# EAGLE design APP_UD_Sigle_new (EAGLE 6.6.0)
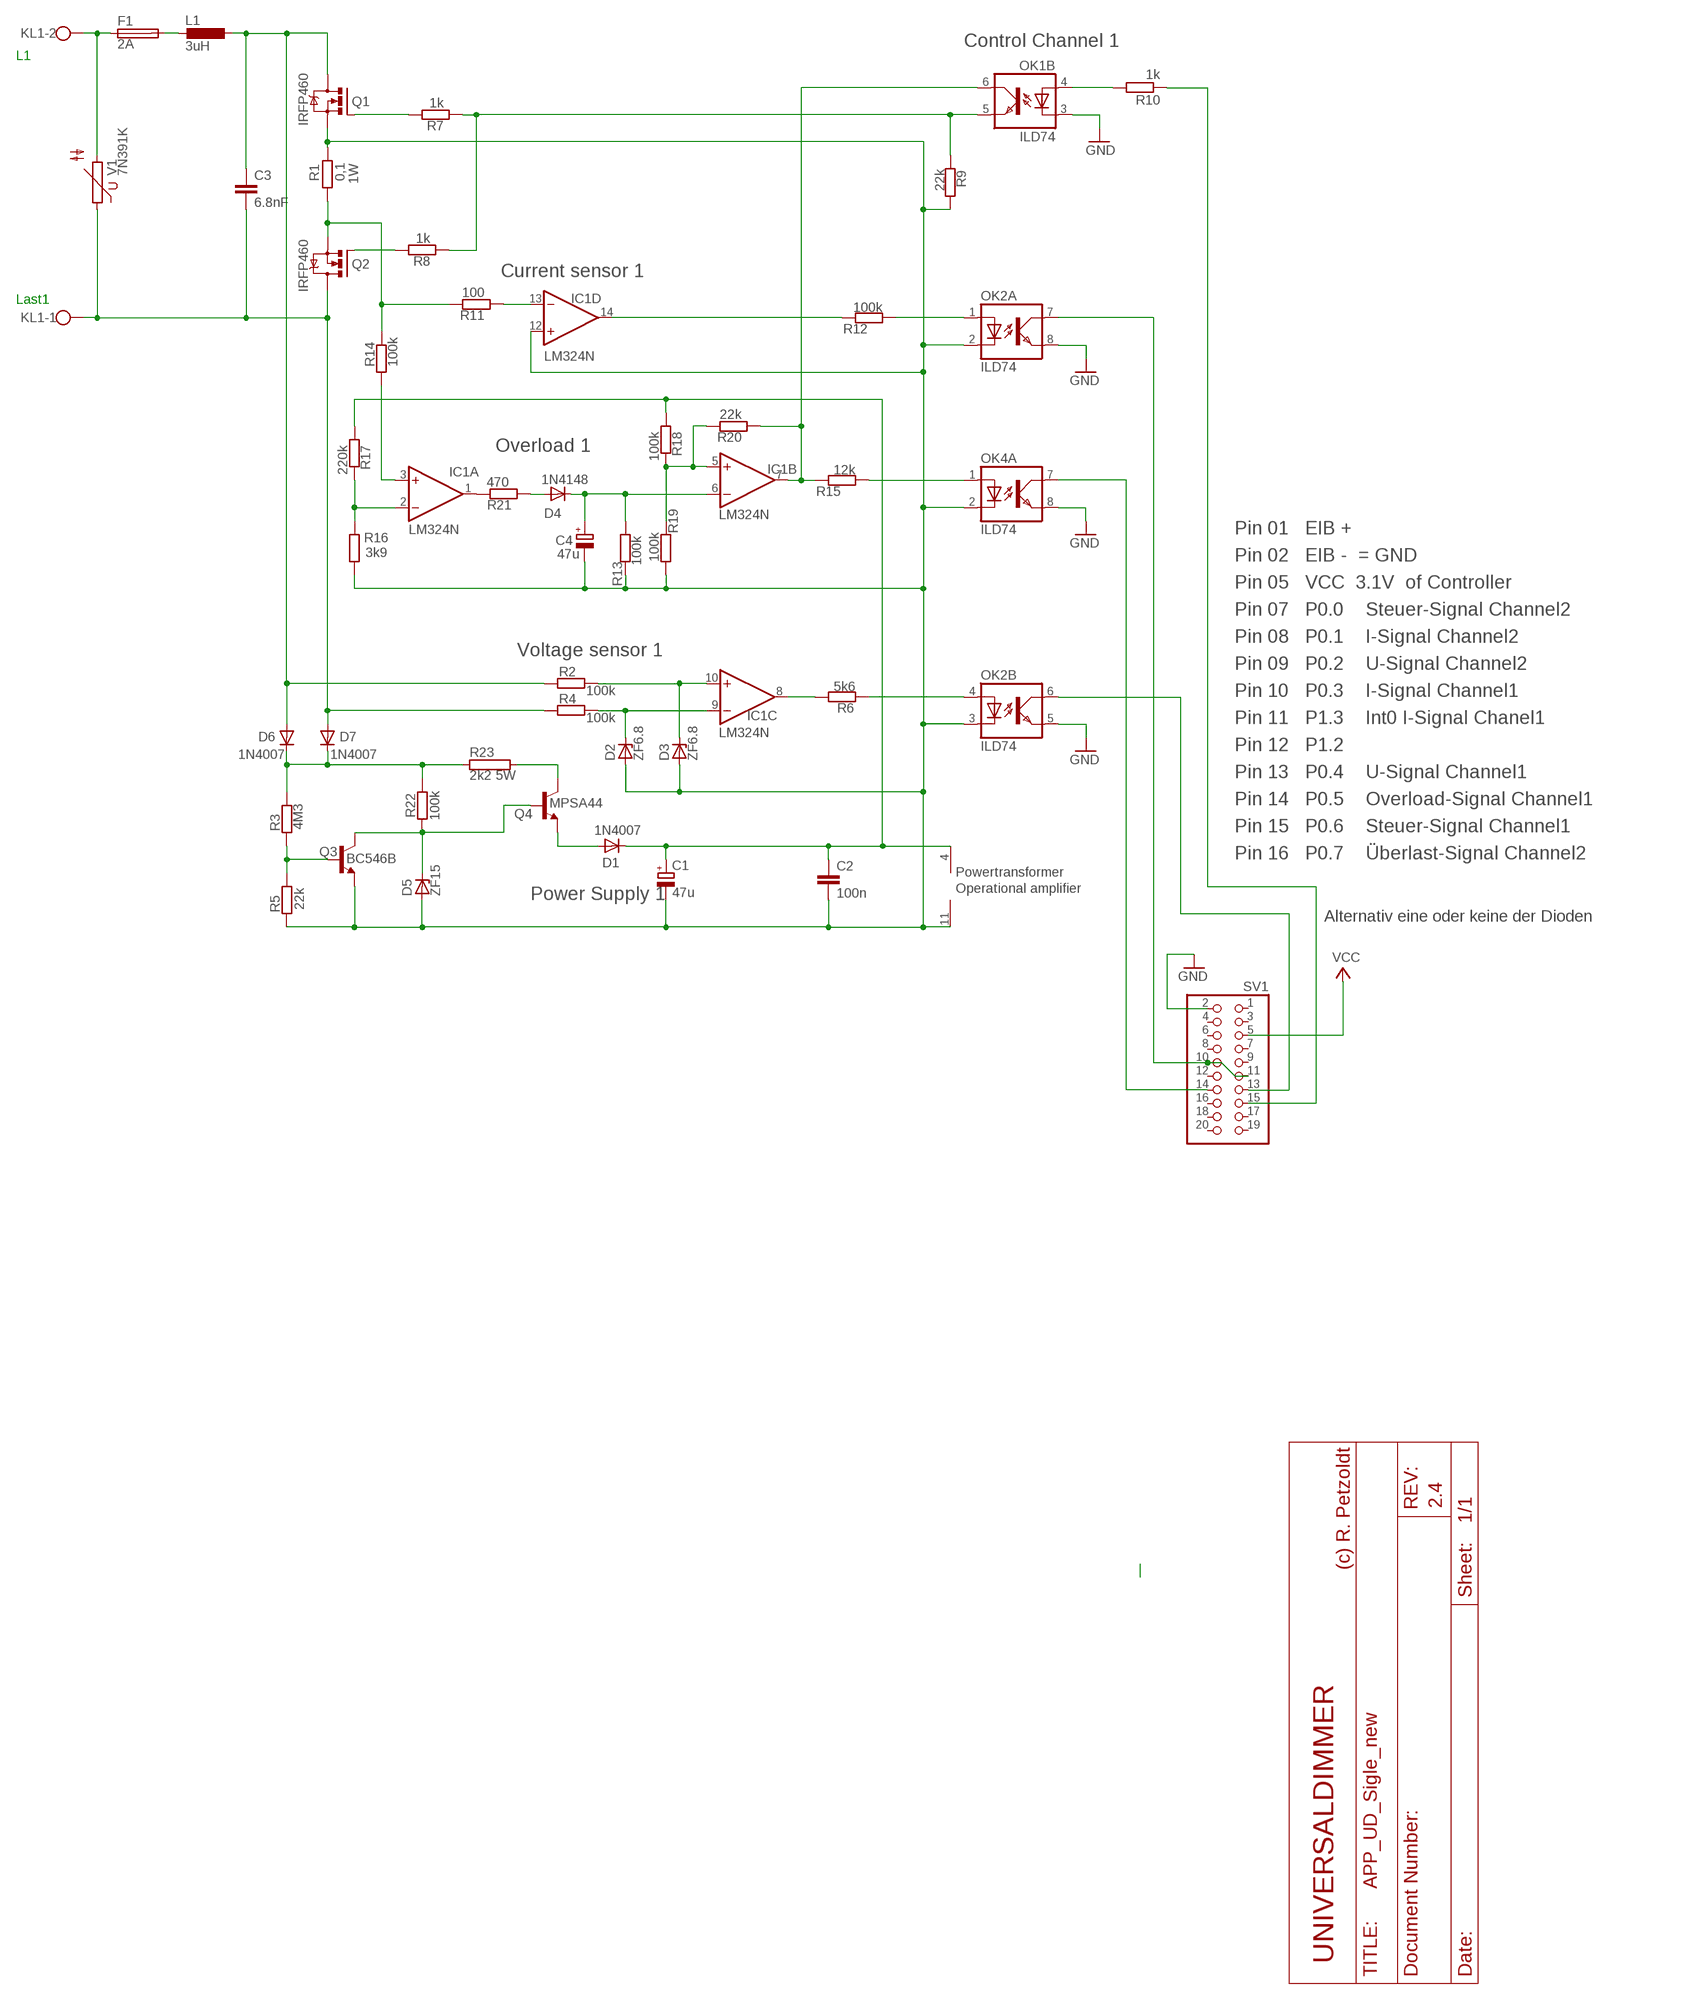
[diagram p0: schematic, sheet 1]
UNIVERSALDIMMER (DOCFIELD): COPYRIGHT: (c) R. Petzoldt; REV: 2.4

## Parts
C1  47u  CPOL-EUE2-5  [E2-5]
C2  100n  C-EU025-030X050  [C025-030X050]
C3  6.8nF  C-EU050-075X075  [C050-075X075]
C4  47u  CPOL-EUE2-5  [E2-5]
D1  1N4007  1N4148DO35-7S  [D-7]
D2  ZF6.8  ZENER-DIODEZD-5  [ZDIO-5]
D3  ZF6.8  ZENER-DIODEZD-7.5  [ZDIO-7.5]
D4  1N4148  1N4148DO35-7S  [D-7]
D5  ZF15  ZENER-DIODEZD-7.5  [ZDIO-7.5]
D6  1N4007  DIODE-D-7.5  [D-7.5]
D7  1N4007  DIODE-D-7.5  [D-7.5]
F1  2A  TR5  [TR5]
IC1  LM324N  [DIL14]
KL1  W237-102  [W237-102]
L1  3uH  L-EU414V  [0414V]
OK1  ILD74  ILD2  [DIL08]
OK2  ILD74  ILD2  [DIL08]
OK4  ILD74  ILD2  [DIL08]
Q1  IRFP460  IRFPC40  [TO247BV]
Q2  IRFP460  IRFPC40  [TO247BV]
Q3  BC546B  [TO92-EBC]
Q4  MPSA44  MPSA44-NPN-TO92-EBC  [TO92-EBC]
R1  0,1  R-EU_0414/5V  [0414V]
R2  100k  R-EU_0204/7  [0204/7]
R3  4M3  R-EU_0204/7  [0204/7]
R4  100k  R-EU_0204/7  [0204/7]
R5  22k  R-EU_0204/7  [0204/7]
R6  5k6  R-EU_0204/7  [0204/7]
R7  1k  R-EU_0204/7  [0204/7]
R8  1k  R-EU_0204/7  [0204/7]
R9  22k  R-EU_0204/7  [0204/7]
R10  1k  R-EU_0204/7  [0204/7]
R11  100  R-EU_0204/7  [0204/7]
R12  100k  R-EU_0204/7  [0204/7]
R13  100k  R-EU_0204/7  [0204/7]
R14  100k  R-EU_0204/7  [0204/7]
R15  12k  R-EU_0204/7  [0204/7]
R16  3k9  R-EU_0204/7  [0204/7]
R17  220k  R-EU_0204/7  [0204/7]
R18  100k  R-EU_0204/7  [0204/7]
R19  100k  R-EU_0204/7  [0204/7]
R20  22k  R-EU_0204/7  [0204/7]
R21  470  R-EU_0204/7  [0204/7]
R22  100k  R-EU_0204/7  [0204/7]
R23  2k2 5W  R  [KH208-8_10B]
SV1  PINHD-2X10  [2X10]
V1  7N391K  S05K11  [S05K11]

## Nets
AGND1: C1.- C2.2 C4.- D2.A D3.A D5.A IC1.11(P:V-) IC1.12(D:+IN) OK2.2(A:C) OK2.3(B:C) OK4.2(A:C) Q1.S Q3.E R1.2 R5.1 R9.2 R13.2 R16.2 R19.1
GND: OK1.3(B:C) OK2.5(B:EMIT) OK2.8(A:EMIT) OK4.8(A:EMIT) SV1.2
N$1: R10.1 SV1.15
N$2: OK1.4(B:A) R10.2
N$3: C3.1 D6.A L1.1 Q1.D R2.1
N$4: Q2.S R1.1 R11.2 R14.2
N$5: OK2.6(B:COL) SV1.13
N$6: IC1.7(B:OUT) OK1.6(B:COL) R15.2 R20.1
N$7: OK2.7(A:COL) SV1.10 SV1.11
N$8: F1.1 KL1.2 V1.2
N$9: Q2.G R8.2
N$11: IC1.3(A:+IN) R14.1
N$12: D6.C D7.C R3.2 R22.2 R23.P$1
N$13: OK2.4(B:A) R6.1
N$15: IC1.8(C:OUT) R6.2
N$16: Q3.B R3.1 R5.2
N$17: Q1.G R7.2
N$18: C3.2 D7.A KL1.1 Q2.D R4.1 V1.1
N$21: IC1.2(A:-IN) R16.1 R17.2
N$22: F1.2 L1.2
N$23: D3.C IC1.10(C:+IN) R2.2
N$24: D2.C IC1.9(C:-IN) R4.2
N$25: IC1.1(A:OUT) R21.2
N$28: OK2.1(A:A) R12.1
N$30: C4.+ D4.C IC1.6(B:-IN) R13.1
N$31: D5.C Q3.C Q4.B R22.1
N$32: OK4.1(A:A) R15.1
N$33: OK4.7(A:COL) SV1.14
N$34: IC1.5(B:+IN) R18.2 R19.2 R20.2
N$35: Q4.C R23.P$2
N$47: D1.A Q4.E
N$48: IC1.14(D:OUT) R12.2
N$64: D4.A R21.1
N$69: OK1.5(B:EMIT) R7.1 R8.1 R9.1
N$74: IC1.13(D:-IN) R11.1
V12-C1: C1.+ C2.1 D1.C IC1.4(P:V+) R17.1 R18.1
VCC: SV1.5
Unconnected: OK1.1(A:A) OK1.2(A:C) OK1.7(A:COL) OK1.8(A:EMIT) OK4.3(B:C) OK4.4(B:A) OK4.5(B:EMIT) OK4.6(B:COL) SV1.1 SV1.3 SV1.4 SV1.6 SV1.7 SV1.8 SV1.9 SV1.12 SV1.16 SV1.17 SV1.18 SV1.19 SV1.20

## Notes on the sheet
- Control Channel 1
- L1
- 1W
- Current sensor 1
- Last1
- Overload 1
- Pin 01   EIB +
- Pin 02   EIB -  = GND
- Pin 05   VCC  3.1V  of Controller
- Pin 07   P0.0    Steuer-Signal Channel2
- Pin 08   P0.1    I-Signal Channel2
- Voltage sensor 1
- Pin 09   P0.2    U-Signal Channel2
- Pin 10   P0.3    I-Signal Channel1
- Pin 11   P1.3    Int0 I-Signal Chanel1
- Pin 12   P1.2
- Pin 13   P0.4    U-Signal Channel1
- Pin 14   P0.5    Overload-Signal Channel1
- Pin 15   P0.6    Steuer-Signal Channel1
- Pin 16   P0.7    Überlast-Signal Channel2
- Powertransformer
- Operational amplifier
- Power Supply 1
- Alternativ eine oder keine der Dioden

## Library data of the parts
C1 C4 = rcl:CPOL-EU: POLARIZED CAPACITOR, European symbol
C2 C3 = rcl:C-EU: CAPACITOR, European symbol
D1 D4 = diode:1N4148: DIODE high speed (Philips)
D2 D3 D5 = diode:ZENER-DIODE: Z-Diode
D6 D7 = diode:DIODE-: DIODE
F1 = fuse:TR5: FUSE Wickmann
IC1 = linear:LM324: OP AMP
KL1 = con-wago-500:W237-102: WAGO SCREW CLAMP
L1 = rcl:L-EU: INDUCTOR, European symbol
OK1 OK2 OK4 = optocoupler:ILD2: SIEMENS OPTO COUPLER
Q1 Q2 = transistor-power:IRFPC40: N-CHANNEL MOS FET
Q3 = transistor-npn:BC546*: NPN Transistor
Q4 = transistor:*-NPN-: NPN Transistror BF959 corrected 2008.03.06
R1-R22 = rcl:R-EU_: RESISTOR, European symbol
R23 = resistor-power:R: Power Resitor
SV1 = pinhead:PINHD-2X10: PIN HEADER
V1 = varistor:S05K11: VARISTOR

## Board
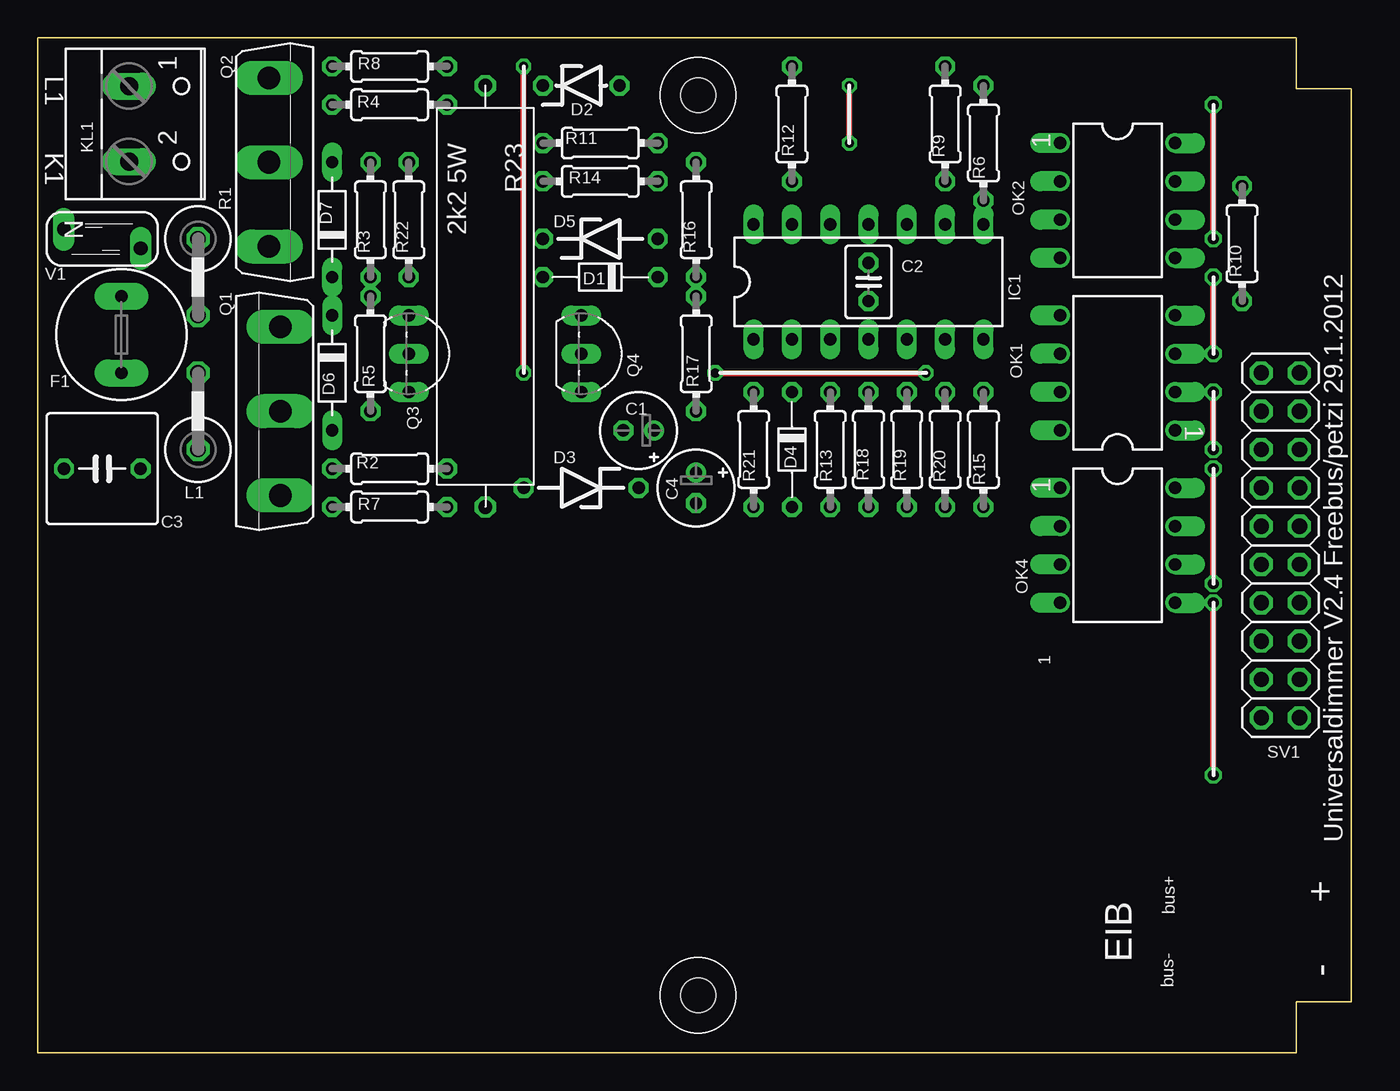
[diagram p1: board, top side]
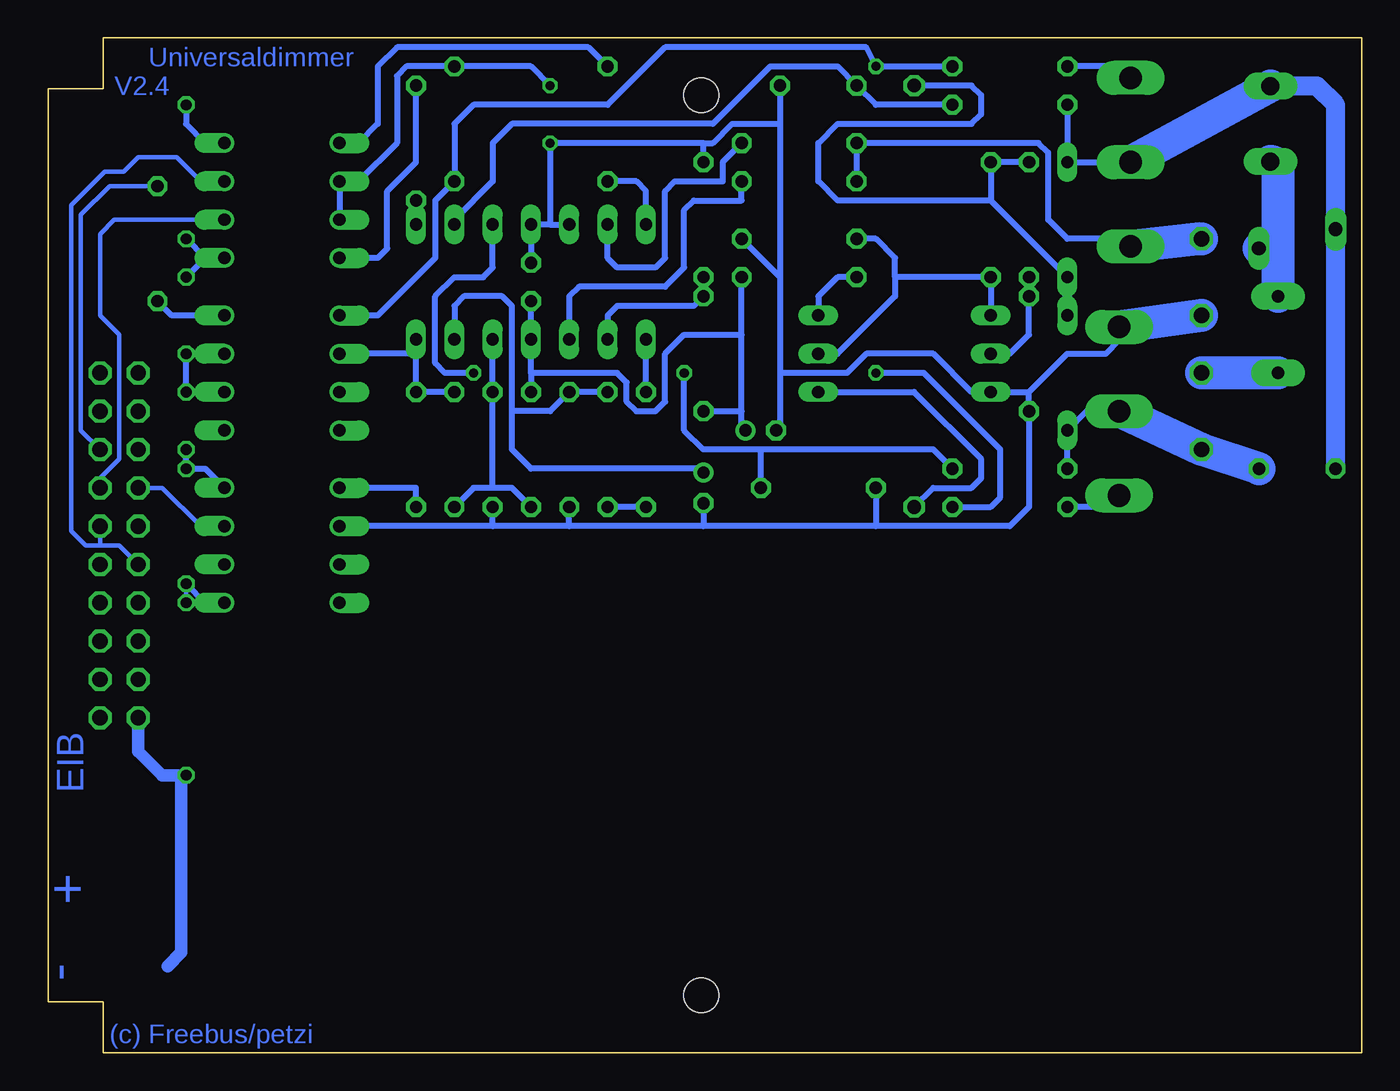
[diagram p2: board, bottom side, seen from below]

Size 87.1 x 67.31 mm. Coordinates in mm from the lower left corner, seen from the top.
Outline: 0,0.01 83.45,0 83.45,3.38 87.1,3.38 87.1,63.93 83.45,63.93 83.45,67.31 0,67.31 0,0.01
Copper layers (1*16): Top 0.035mm / dielectric 1.5mm / Bottom 0.035mm
Design rules "default": minimum track width 10mil, minimum drill 23mil, track to track 12mil, track to pad 12mil, pad to pad 16mil, via to via 16mil, smd to smd 8mil, copper to edge 10mil, drill to drill 10mil, minimum pad ring 10mil, minimum via ring 8mil, stop-mask expansion 4mil, vias tented up to drill 0mil, thermal gap 10mil
Holes 2.3 mm at 43.79,3.81 43.79,63.5

### Footprints (pad centres in the part's own frame; a part is rotated, then mirrored left to right if it is on the bottom)
E2-5 = drill 0.813 pad 1.27: + -1.016,0 | drill 0.813 pad 1.27 octagon: - 1.016,0
C025-030X050 = drill 0.813 octagon: 1 -1.27,0; 2 1.27,0
C050-075X075 = drill 0.813 octagon: 1 -2.54,0; 2 2.54,0
D-7 = drill 0.813 octagon: A 3.81,0; C -3.81,0
ZDIO-5 = drill 0.813 octagon: A 2.54,0; C -2.54,0
ZDIO-7.5 = drill 0.813 octagon: A 3.81,0; C -3.81,0
D-7.5 = drill 0.813 long: A 3.81,0; C -3.81,0
TR5 = drill 0.813 pad 1.778 long: 1 -2.54,0; 2 2.54,0
DIL14 = drill 0.813 long: 1 -7.62,-3.81; 2 -5.08,-3.81; 3 -2.54,-3.81; 4 0,-3.81; 5 2.54,-3.81; 6 5.08,-3.81; 7 7.62,-3.81; 8 7.62,3.81; 9 5.08,3.81; 10 2.54,3.81; 11 0,3.81; 12 -2.54,3.81; 13 -5.08,3.81; 14 -7.62,3.81
W237-102 = drill 1.194 long: 1 -2.5,-1.27; 2 2.5,-1.27
0414V = drill 1.016 octagon: 1 -2.54,0; 2 2.54,0
DIL08 = drill 0.813 offset: 1 -3.81,-3.81; 2 -1.27,-3.81; 3 1.27,-3.81; 4 3.81,-3.81; 5 3.81,3.81; 6 1.27,3.81; 7 -1.27,3.81; 8 -3.81,3.81
TO247BV = drill 1.499 long: D 0,-2.921; G -5.588,-2.921; S 5.588,-2.921
TO92-EBC = drill 0.813 long: B 0,-1.27; C -2.54,-1.27; E 2.54,-1.27
TO92-EBC' = drill 0.813 long: B 0,-1.27; C 2.54,-1.27; E -2.54,-1.27
0204/7 = drill 0.813 octagon: 1 -3.81,0; 2 3.81,0
KH208-8_10B = drill 0.9 octagon: P$1 -13.97,0; P$2 13.97,0
2X10 = drill 1.016 octagon: 1 -11.43,-1.27; 2 -11.43,1.27; 3 -8.89,-1.27; 4 -8.89,1.27; 5 -6.35,-1.27; 6 -6.35,1.27; 7 -3.81,-1.27; 8 -3.81,1.27; 9 -1.27,-1.27; 10 -1.27,1.27; 11 1.27,-1.27; 12 1.27,1.27; 13 3.81,-1.27; 14 3.81,1.27; 15 6.35,-1.27; 16 6.35,1.27; 17 8.89,-1.27; 18 8.89,1.27; 19 11.43,-1.27; 20 11.43,1.27
S05K11 = drill 0.914 long: 1 -0.635,-2.54; 2 0.635,2.54

### Placement (x,y rotation side)
C1  39.84,41.27 180 top
C2  55.08,51.12 90 top
C3  4.28,38.73 180 top
C4  43.65,37.46 270 top
D1  37.3,51.43 180 top
D2  36.03,64.14 0 top
D3  36.03,37.46 180 top
D4  50,40 270 top
D5  37.3,53.98 0 top
D6  19.52,45.09 270 top
D7  19.52,55.24 90 top
F1  5.55,47.62 270 top
IC1  55.08,51.12 0 top
KL1  7.32,61.59 270 top
L1  10.63,42.54 90 top
OK1  71.59,45.09 90 top
OK2  71.59,56.52 270 top
OK4  71.59,33.66 270 top
Q1  13.17,42.54 90 top
Q2  18.25,59.05 270 top
Q3  25.87,46.35 270 top
Q4  MPSA44  [TO92-EBC']  37.3,46.35 270 top
R1  10.63,51.43 270 top
R2  23.33,38.73 0 top
R3  22.06,55.24 90 top
R4  23.33,62.86 0 top
R5  22.06,46.35 90 top
R6  62.7,60.32 270 top
R7  23.33,36.2 180 top
R8  23.33,65.41 180 top
R9  60.16,61.59 90 top
R10  79.84,53.66 270 top
R11  37.3,60.32 180 top
R12  50,61.59 270 top
R13  52.54,40 270 top
R14  37.3,57.78 180 top
R15  62.7,40 90 top
R16  43.65,55.24 90 top
R17  43.65,46.35 90 top
R18  55.08,40 270 top
R19  57.62,40 90 top
R20  60.16,40 270 top
R21  47.46,40 90 top
R22  24.6,55.24 90 top
R23  29.68,50.16 270 top
SV1  82.38,33.66 90 top
V1  4.28,53.98 270 top

### Tracks (layer width: path | path; a pad name or v marks a point on that pad's centre or on a via)
AGND1  (via drill 0.6)
  Top 0.406: v53.81,60.32 v53.81,64.14
  Bottom 0.406: 52.54,34.92 57.62,34.92 | 57.62,34.92 OK4.2 | 52.54,34.92 R13.2 | 57.62,34.92 R19.1 | 32.22,34.92 23.33,34.92 22.06,36.2 R5.1 22.06,43.81 | 32.22,34.92 43.65,34.92 | 43.65,34.92 52.54,34.92 | OK2.3 OK2.2 66.51,57.78 63.97,60.32 63.97,64.77 63.34,65.41 R9.2 55.08,65.41 v53.81,64.14 | 53.81,54.93 IC1.12 | 53.81,54.93 IC1.11 C2.2 | 53.81,54.93 v53.81,60.32 43.65,60.32 | R16.2 43.65,60.32 | 38.57,61.59 38.57,51.43 | 38.57,51.43 38.57,45.09 | 38.57,45.09 38.57,41.27 C1.- | 43.65,60.32 43.02,60.32 41.75,61.59 38.57,61.59 | D2.A 38.57,61.59 | D5.A 38.57,51.43 | C4.- 43.65,34.92 | D3.A 32.22,34.92 | 22.06,43.81 19.52,46.35 16.98,46.35 16.09,47.24 Q1.S | 22.06,43.81 Q3.E 25.87,43.81 28.41,46.35 32.85,46.35 34.12,45.09 38.57,45.09
  Bottom 2.184: R1.2 Q1.S
GND  (via drill 0.7)
  Top 0.406: v77.94,53.98 v77.94,62.86 | v77.94,46.35 v77.94,51.43 | v77.94,40 v77.94,43.81 | v77.94,31.12 v77.94,38.73 | v77.94,18.42 v77.94,29.85
  Bottom 0.305: v77.94,29.85 v77.94,31.12
  Bottom 0.406: OK2.8 76.67,60.32 77.94,61.59 v77.94,62.86 | 76.67,52.7 OK2.5 | 76.67,52.7 v77.94,53.98 | v77.94,51.43 76.67,52.7 | OK1.3 v77.94,46.35 v77.94,43.81 | OK4.8 76.67,38.73 v77.94,38.73 v77.94,40 | v77.94,31.12 76.67,29.85
  Bottom 0.813: SV1.2 81.11,20 79.53,18.42 v77.94,18.42 78.26,18.1 78.26,15.88 78.26,15.24 78.26,6.67 79.17,5.75
N$1
  Bottom 0.305: SV1.15 84.92,41.27 84.92,55.56 83.02,57.47 R10.1
N$2
  Bottom 0.406: 76.67,48.89 OK1.4 78.89,48.89 R10.2
N$3
  Bottom 0.406: R2.1 D6.A 18.25,42.54 Q1.D
  Bottom 2.184: Q1.D L1.1 C3.1
N$4
  Bottom 0.406: Q2.S 15.84,53.98 19.52,53.98 20.79,55.24 20.79,59.69 21.42,60.32 R11.2 R14.2
  Bottom 2.184: R1.1 Q2.S
N$5
  Bottom 0.305: SV1.13 83.66,38.1 82.38,39.37 82.38,47.62 83.66,48.89 83.66,54.29 82.7,55.24 OK2.6
N$6
  Bottom 0.406: 62.7,46.35 R15.2 R20.1 | 62.7,46.35 IC1.7 | 62.7,46.35 OK1.6
N$7
  Bottom 0.305: SV1.10 82.38,33.66 83.66,33.66 | OK2.7 76.99,57.78 78.57,59.37 81.11,59.37 82.07,58.42 83.34,58.42 85.56,56.2 85.56,34.61 84.61,33.66 83.66,33.66 | 83.66,33.66 SV1.11
N$8
  Bottom 2.184: F1.1 5.55,53.98 | 5.55,53.98 5.55,58.59 arc-90 KL1.2 | V1.2 6.19,53.34 arc-90 5.55,53.98
N$9
  Bottom 0.406: R8.2 16.09,65.41 Q2.G
N$11
  Bottom 0.406: R14.1 41.11,56.52 44.29,56.52 44.92,55.88 44.92,52.07 46.19,50.8 51.91,50.8 52.54,50.16 IC1.3
N$12
  Bottom 0.406: R3.2 R22.2 24.6,56.52 | 24.6,56.52 34.76,56.52 36.03,57.78 36.03,60.32 34.76,61.59 25.87,61.59 25.23,62.23 25.23,63.5 25.87,64.14 R23.P$1 | 24.6,56.52 D7.C
  Bottom 0.61: D6.C D7.C
N$13
  Bottom 0.406: R6.1 62.7,59.05 64.61,57.15 64.61,53.34 65.24,52.7 OK2.4
N$15
  Bottom 0.406: IC1.8 R6.2
N$16
  Bottom 0.406: R3.1 R5.2 22.06,47.62 23.33,46.35 Q3.B
N$17
  Bottom 0.406: Q1.G 16.85,36.2 R7.2
N$18
  Bottom 0.406: 15.71,59.44 Q2.D D7.A R4.1
  Bottom 1.27: C3.2 V1.1 1.74,62.86 2.97,64.09 KL1.1
  Bottom 2.184: KL1.1 Q2.D
N$21
  Bottom 0.406: IC1.2 50,48.89 49.37,49.53 44.29,49.53 R17.2 R16.1
N$22
  Bottom 2.184: F1.2 L1.2
N$23  (via drill 0.6)
  Top 0.406: v44.92,45.09 v58.89,45.09
  Bottom 0.406: IC1.10 57.62,52.07 58.26,51.43 60.16,51.43 61.43,50.16 61.43,45.72 60.8,45.09 v58.89,45.09 | 39.84,40 28.41,40 R2.2 | D3.C 39.84,40 | 39.84,40 43.65,40 44.92,41.27 v44.92,45.09
N$24
  Bottom 0.406: IC1.9 60.16,55.24 57.62,57.78 57.62,60.32 56.35,61.59 43.02,61.59 39.21,65.41 34.76,65.41 D2.C 32.22,62.86 R4.2
N$25
  Bottom 0.406: R21.2 IC1.1
N$28
  Bottom 0.406: OK2.1 66.51,60.32 65.24,61.59 65.24,65.41 63.97,66.68 51.27,66.68 R12.1
N$30
  Bottom 0.406: 60.16,47.62 IC1.6 60.16,49.53 59.52,50.16 56.98,50.16 56.35,49.53 56.35,42.54 | C4.+ 43.65,38.73 55.08,38.73 56.35,40 56.35,42.54 | D4.C R13.1 53.81,42.54 56.35,42.54
N$31
  Bottom 0.406: Q3.C R22.1 30.95,51.43 | 30.95,51.43 30.95,50.16 34.76,46.35 Q4.B | 30.95,51.43 30.95,52.7 32.22,53.98 D5.C
N$32
  Bottom 0.406: OK4.1 62.7,37.46 R15.1
N$33
  Bottom 0.305: SV1.14 79.53,37.46 76.99,34.92 OK4.7
N$34
  Bottom 0.406: IC1.5 R19.2 57.62,37.46 | R18.2 56.35,37.46 57.62,37.46 | 57.62,37.46 58.89,37.46 R20.2
N$35
  Bottom 0.406: Q4.C 29.68,43.81 25.23,39.37 25.23,38.1 25.87,37.46 28.41,37.46 R23.P$2
N$41  (via drill 0.6)
  other vias: 43.79,63.5
N$47
  Bottom 0.406: D1.A 34.76,51.43 36.03,50.16 Q4.E
N$48
  Bottom 0.406: R12.2 48.09,57.78 47.46,57.15 IC1.14
N$64
  Bottom 0.406: R21.1 D4.A
N$67  (via drill 0.6)
  other vias: 43.79,3.81
N$69  (via drill 0.6)
  Top 0.406: v32.22,45.09 v32.22,65.41
  Bottom 0.406: R8.1 v32.22,65.41 32.85,66.68 46.19,66.68 50,62.86 58.89,62.86 60.16,61.59 R9.1 61.43,56.52 61.43,52.7 65.24,48.89 OK1.5 | R7.1 24.6,36.2 23.96,36.83 23.96,40 29.04,45.09 v32.22,45.09
N$74
  Bottom 0.406: IC1.13 50,52.7 49.37,52.07 46.83,52.07 46.19,52.7 46.19,57.15 45.55,57.78 42.38,57.78 42.38,59.05 R11.1
V12-C1
  Bottom 0.406: 55.08,45.09 IC1.4 C2.1 | 41.11,47.62 44.92,47.62 46.19,46.35 46.19,43.18 46.83,42.54 48.09,42.54 48.73,43.18 48.73,44.45 49.37,45.09 55.08,45.09 | 55.08,45.09 R18.1 | 41.11,47.62 D1.C | 41.11,42.54 41.11,41.27 C1.+ 40.79,41.27 | 41.11,42.54 41.11,47.62 | R17.1 41.11,42.54

### Text on the board
Bottom: Universaldimmer | V2.4 | EIB | + | - | (c) Freebus/petzi
tPlace: L1 | K1 | 1 | N | 1 | 1 | 1 | Universaldimmer V2.4 Freebus/petzi 29.1.2012 | bus+ | + | EIB | bus- | -
Outside: 1 | 2 | 8 | 9 | 24 | 25